# Altium schematic sheet TMR_MAGSAT.SchDoc
size A4; SheetNumber: 1; SheetTotal: 1
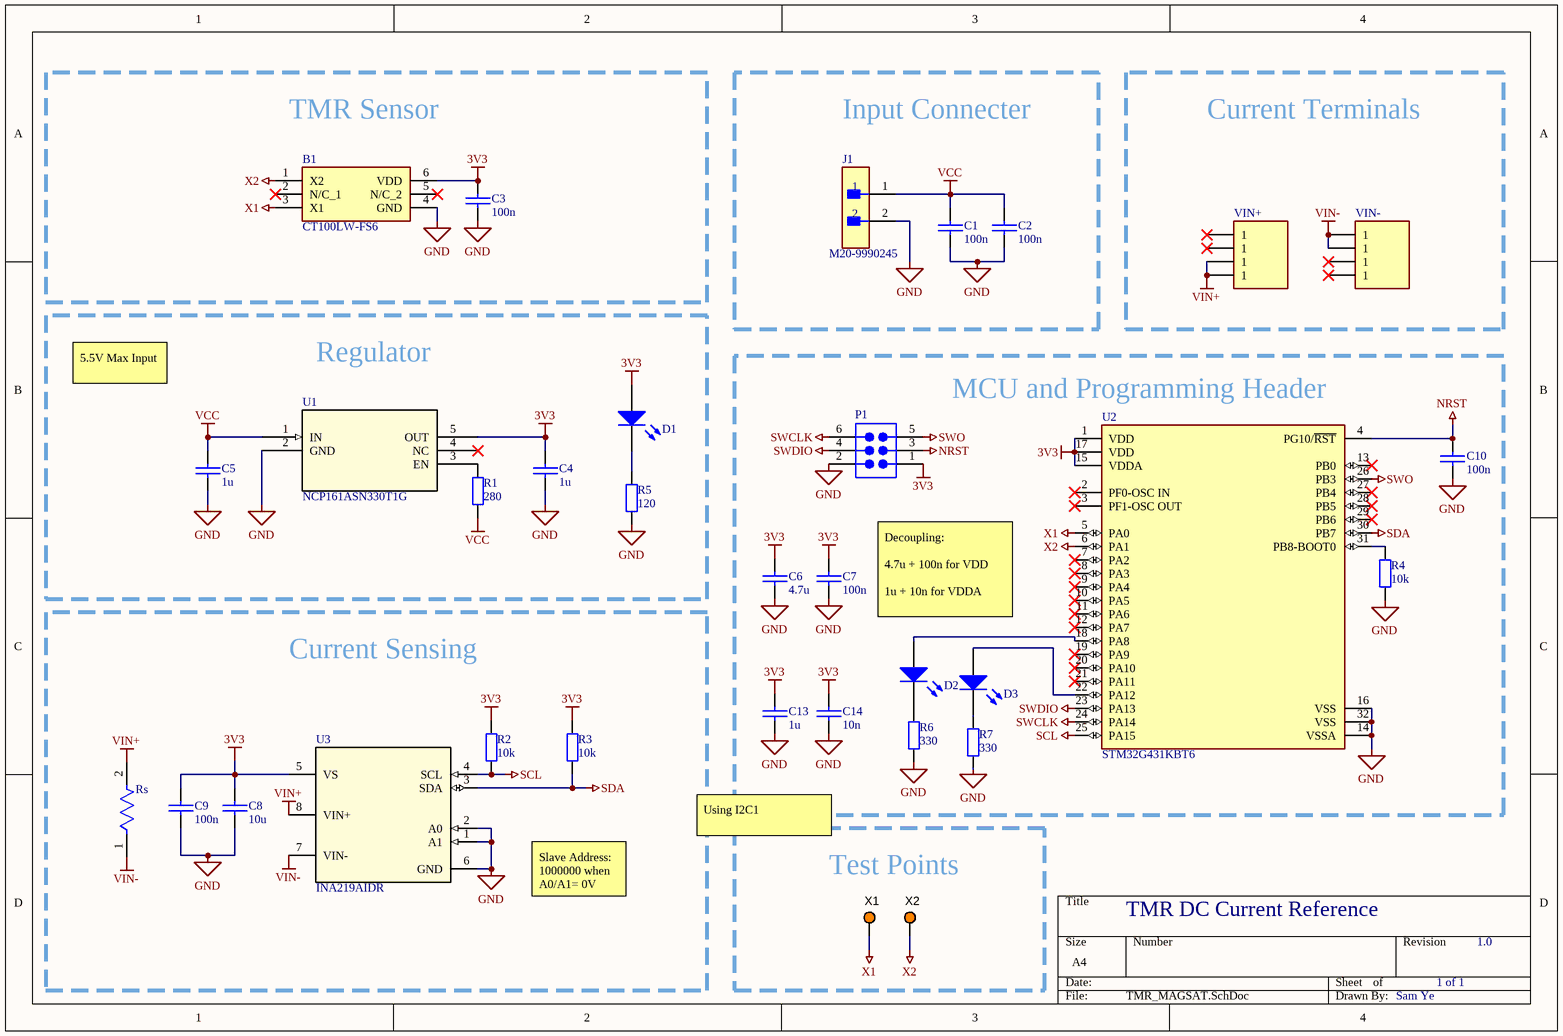
[diagram p0: TMR_MAGSAT.SchDoc]

## Parts
B1  CT100LW-FS6  [SOT95P280X135-6N]
C1  100n  [0805 CAP]
C2  100n  [0805 CAP]
C3  100n  [0805 CAP]
C4  1u  [0805 CAP]
C5  1u  [0805 CAP]
C6  4.7u  [0805 CAP]
C7  100n  [0805 CAP]
C8  10u  [0805 CAP]
C9  100n  [0805 CAP]
C10  100n  [0805 CAP]
C13  1u  [0805 CAP]
C14  10n  [0805 CAP]
D1  LTST-C170KGKT  [0805 LED]  (value not drawn)
D2  LTST-C170KGKT  [0805 LED]  (value not drawn)
D3  LTST-C170KGKT  [0805 LED]  (value not drawn)
J1  M20-9990245  [FP-M20-9990245-MFG]
P1  MTSW-103-07-F-D-244  [SMTC-MTSW-103-07-X-D-244]  (value not drawn)
R1  280  [0805 RES]
R2  10k  [0805 RES]
R3  10k  [0805 RES]
R4  10k  [0805 RES]
R5  120  [0805 RES]
R6  330  [0805 RES]
R7  330  [0805 RES]
Rs  PA2512FKM7W0R001E  [FP-PA2512E-0R001-0R004-IPC_A]  (value not drawn)
U1  NCP161ASN330T1G  [SOT23_527AH_ONS]
U2  STM32G431KBT6  [FP-LQFP32-5V-IPC_B]
U3  INA219AIDR  [D0008A_N]
VIN+  7771  [KEYSTONE_7771]  (value not drawn)
VIN-  7771  [KEYSTONE_7771]  (value not drawn)
X1  5003  [TP_TH]  (value not drawn)
X2  5003  [TP_TH]  (value not drawn)

## Blocks framed on the sheet
TMR Sensor: B1 C3
Input Connecter: C1 C2 J1
Current Terminals: VIN+ VIN-
Regulator: C4 C5 D1 R1 R5 U1
MCU and Programming Header: C6 C7 C10 C13 C14 D2 D3 P1 R4 R6 R7 U2
Current Sensing: C8 C9 R2 R3 Rs U3
Test Points: X1 X2

## Nets
3V3: B1.6(VDD) C3.1 C4.1 C6.1 C7.1 C8.1 C9.1 C13.1 C14.1 D1.1(A) P1.1 R2.2 R3.2 U1.5(OUT) U2.1(VDD) U2.15(VDDA) U2.17(VDD) U3.5(VS)
GND: B1.4(GND) C1.2 C2.2 C3.2 C4.2 C5.2 C6.2 C7.2 C8.2 C9.2 C10.2 C13.2 C14.2 J1.2 P1.2 R4.1 R5.1 R6.1 R7.1 U1.2(GND) U2.14(VSSA) U2.16(VSS) U2.32(VSS) U3.1(A1) U3.2(A0) U3.6(GND)
NRST: C10.1 P1.3 U2.4(PG10/~{RST})
SCL: R2.1 U2.25(PA15) U3.4(SCL)
SDA: R3.1 U2.30(PB7) U3.3(SDA)
SWCLK: P1.6 U2.24(PA14)
SWDIO: P1.4 U2.23(PA13)
SWO: P1.5 U2.26(PB3)
VCC: C1.1 C2.1 C5.1 J1.1 R1.1 U1.1(IN)
VIN+: Rs.2 U3.8(VIN+) VIN+.1_3(1) VIN+.1_4(1)
VIN-: Rs.1 U3.7(VIN-) VIN-.1_1(1) VIN-.1_2(1)
X1: B1.3(X1) U2.5(PA0) X1.1
X2: B1.1(X2) U2.6(PA1) X2.1
NetD1_2: D1.2(K) R5.2
NetD2_1: D2.1(A) U2.18(PA8)
NetD2_2: D2.2(K) R6.2
NetD3_1: D3.1(A) U2.22(PA12)
NetD3_2: D3.2(K) R7.2
NetR1_2: R1.2 U1.3(EN)
NetR4_2: R4.2 U2.31(PB8-BOOT0)

Not connected (* = marked no-connect by the designer): B1 2(N/C_1)* 5(N/C_2)*; U1 4(NC)*; U2 2(PF0-OSC_IN)* 3(PF1-OSC_OUT)* 7(PA2)* 8(PA3)* 9(PA4)* 10(PA5)* 11(PA6)* 12(PA7)* 13(PB0)* 19(PA9)* 20(PA10)* 21(PA11)* 27(PB4)* 28(PB5)* 29(PB6)*; VIN+ 1_1(1)* 1_2(1)*; VIN- 1_3(1)* 1_4(1)*

## Notes on the sheet
- 5.5V Max Input
- Decoupling:
  4.7u + 100n for VDD
  1u + 10n for VDDA
- Using I2C1
- Slave Address:
  1000000 when A0/A1= 0V
- TMR DC Current Reference
- 1 of 1
- 1.0
- Sam Ye

## Library data of the parts
B1 = CT100LW-FS6: Board Mount Hall Effect / Magnetic Sensors Differential TMR High Sensitivity Magnetic 1D Linear  Sensor ,SOT23 - 6 pin Package, F-Temp; Manufacturer_Name: Allegro Microsystems; Geometry.Height: 1.35mm; Mouser Part Number: *; Mouser Price/Stock: *; Manufacturer_Part_Number: CT100LW-FS6; Datasheet Link: *
C1-C10 C13 C14 = CerCap_SMT_0805: SMT ceramic capacitor 0805 size; Value: *
D1-D3 = LED_SMT_0805: SMT LED 0805 size; Manufacturer: Lite-On Inc.; Color: Green; Lens Color: Colorless; Lens Transparency: Clear; Millicandela Rating: 35mcd; Lens Style/Size: Rectangle with Flat Top, 1.40mm x 1.25mm; Voltage - Forward (Vf) (Typ): 2V; Current - Test: 20mA; Viewing Angle: 130°; Wavelength - Dominant: 571nm; Wavelength - Peak: 574nm; Supplier 1: Digi-Key; Manufacturer Part Number: LTST-C170KGKT; RoHS: RoHS Compliant; Category: Optoelectronics; Stock 1: 503069; Pricing 1: 1=0.62, 10=0.459, 25=0.338, 100=0.2415, 250=0.16416, 500=0.14486, 1000=0.11347 (NZD); Packaging: Cut Tape (CT); Part Status: Active; Mounting Type: Surface Mount; Features: -; Package / Case: 0805 (2012 Metric); Size / Dimension: 2.00mm L x 1.25mm W; Height (Max): 1.10mm; ComponentLink1URL: http://optoelectronics.liteon.com/upload/download/DS22-2000-073/LTST-C170KGKT.pdf; ComponentLink1Description: http://optoelectronics.liteon.com/upload/download/DS22-2000-073/LTST-C170KGKT.pdf; Supplier Part Number 1: 160-1414-1-ND
J1 = CMP-15831-000105-1: CONN HEADER VERT 2POS 2.54MM; Working Voltage: 750V; Gender: Male; Number of Poles: 2; Current Rating: 3A; Mated Stacking Heights: 16.54mm; Contact Resistance: 25mR; Connector Type: Male Pin; Insulation Resistance: 10GR; Mating Cycles: 300; Voltage: 50V; Flammability Rating: UL94 V-0; Pitch: 2.54mm; Series: M20; Number of Contacts: 2; Height: 0.12inch; Min Operating Temperature: -40°C; Contact Finish - Mating: GOLD; Number of Positions: 2; Number of Rows: 1; Packaging: Bulk; Package Quantity: 1000; Voltage Rating (AC): 750V; Current: 3A; Mount: Through Hole; Case/Package: SIL; Orientation: Straight; Contact Shape: Square; Weight: 0.25lb; Radiation Hardening: No; Fastening Type: Pull; Length: 5.08mm; Depth: 2.54mm; Contact Mating Length: 0.24inch; Housing Material: Nylon; Reach SVHC Compliant: Yes; Insulation Material: Nylon; Color: Black; Width: 0.25inch; Insulation Color: Black; Contact Material: Brass; Contact Type: Male Pin; Termination: Solder; Max Operating Temperature: 105°C; Contact Plating: Gold; Housing Color: Black; Max Current Rating: 3A; Lead Pitch: 2.54mm
P1 = CMP-1024-00098-1: Modified .025" SQ Post Header, Through-hole, Vertical, -55 to 125 degC, 2.54 mm Pitch, 6-Pin, Male, RoHS; Manufacturer: Samtec; Pitch: 2.54 mm; DatasheetVersion: F-214; Orientation: Vertical; PackageDescription: Assembly .025" [.64] SQ Post Terminal Strip; ComponentLink1Description: Manufacturer URL; ComponentLink3Description: Package Specification; PackageVersion: BI, 2/1987; ComponentLink1URL: http://www.samtec.com; PackageReference: MTSW-103-07-X-D-244; ComponentLink3URL: http://www.samtec.com/documents/webfiles/cpdf/MTSW-XXX-XX-X-X-XXXX-XX-XXX-MKT1.pdf; Temperature Range: -55 to 125 degC; Mounting Technology: Through-hole; PartNumber: MTSW-103-07-F-D-244; RoHS: True; ComponentLink2URL: http://www.samtec.com/documents/webfiles/pdf/MTSW.PDF; ComponentLink2Description: Datasheet
R1-R7 = Res_SMT_0805: 0805 resistor; Published: 8-Jun-2000; LatestRevisionDate: 17-Jul-2002; LatestRevisionNote: Re-released for DXP Platform.; PackageReference: AXIAL-0.4; Publisher: Altium Limited; Value: *; ComponentLink1Description: https://nz.mouser.com/datasheet/2/315/AOA0000C304-1149620.pdf
Rs = CMP-03412-024792-1: METAL CURRENT SENSOR 2512 1% 75P; Manufacturer: Yageo; Resistance: 1mΩ; Power Rating: 2W; Temperature Coefficient: 75ppm/°C; Value: 1mΩ; Automotive Grade: Grade 0; Lead Free: Yes; Ipc Land Pattern Name: RESC635318X63; Series: PA_E; Digikey Description: METAL CURRENT SENSOR 2512 1% 75P; Temperature: -55°C to +170°C; ComponentLink2URL: http://www.yageo.com/documents/recent/PYu-PA_E_51_RoHS_10.pdf; Device Class L1: Passive Components; Octopart: https://octopart.com/pa2512fkm7w0r001e-yageo-94661137; Category: Res; RoHS: TRUE; Device Class L2: Resistors; Tolerance: 1%; ComponentLink2Description: Datasheet; Composition: Metal Element; Manufacturer Part Number: PA2512FKM7W0R001E; Temperature Range High: +170°C; Temperature Range Low: -55°C; Height: 0.88mm; Device Class L3: Chip SMD Resistors; Automotive: Yes; Package: PA2512E-0R001-0R004
U1 = NCP161ASN330T1G: Description; Manufacturer_Name: onsemi; Copyright: Copyright (C) 2026 Ultra Librarian. All rights reserved.; Manufacturer_Part_Number: NCP161ASN330T1G; RefDes: RefDes; Type: Type
U2 = CMP-12105-000140-1: IC MCU 32BIT 128KB FLASH 32LQFP
U3 = INA219AIDR: 26-V 12-bit I2C output digital power monitor 8-SOIC -40 to 125; Manufacturer_Name: Texas Instruments; PartNumber: INA219BIDR; Alternate_PartNumber: INA219BID; CompType: IC; TYPE: TYPE; RefDes: RefDes; Copyright: Copyright (C) 2026 Ultra Librarian. All rights reserved.; Manufacturer_Part_Number: INA219AIDR; PackageReference: D0008A; MountType: SMT; RoHS: Y; Manufacturer: Texas Instruments
VIN+ VIN- = 7771: Screw Terminal;Nickel;15 Amp;Thru-Hole;Vertical;Unassembled;PC;M3 | Keystone Electronics 7771; SnapEDA_Link: https://www.snapeda.com/parts/7771/Keystone/view-part/?ref=snap; Package: None; Value: *; MF: Keystone Electronics; MP: 7771; Check_prices: https://www.snapeda.com/parts/7771/Keystone/view-part/?ref=eda
X1 X2 = TestPoint: Test Point, Orange, 1-Pin THD, RoHS; Peak Reverse Current: 600 uA; Forward Current: 3 A; Max Surge Current: 80 A; Forward Voltage: 1.08 V; Max Operating Temperature: 150 degC; PackageReference: 5003; Pins: 2; ComponentLink2URL: http://keyelco.com/userAssets/file/M65p56.pdf; PackageDescription: 1-Pin Through Hole Device, Dia 2.54 mm; Weight: 0.01 lb; Diameter: 5.3 mm; Mount: Through Hole; Package Quantity: 500; Packaging: Bulk; Min Operating Temperature: -65 degC; ComponentLink1Description: Manufacturer URL; Height: 0.25 inch; ComponentLink1URL: http://www.keyelco.com/; ComponentLink2Description: Datasheet; Width: 0.25 inch; REACH SVHC: No SVHC; RoHSCompliant: true; Radiation Hardening: No; Length: 9.5 mm; DatasheetVersion: Jun-15